# EAGLE design control (EAGLE 8.1.0)

## Sheet 1 of 3
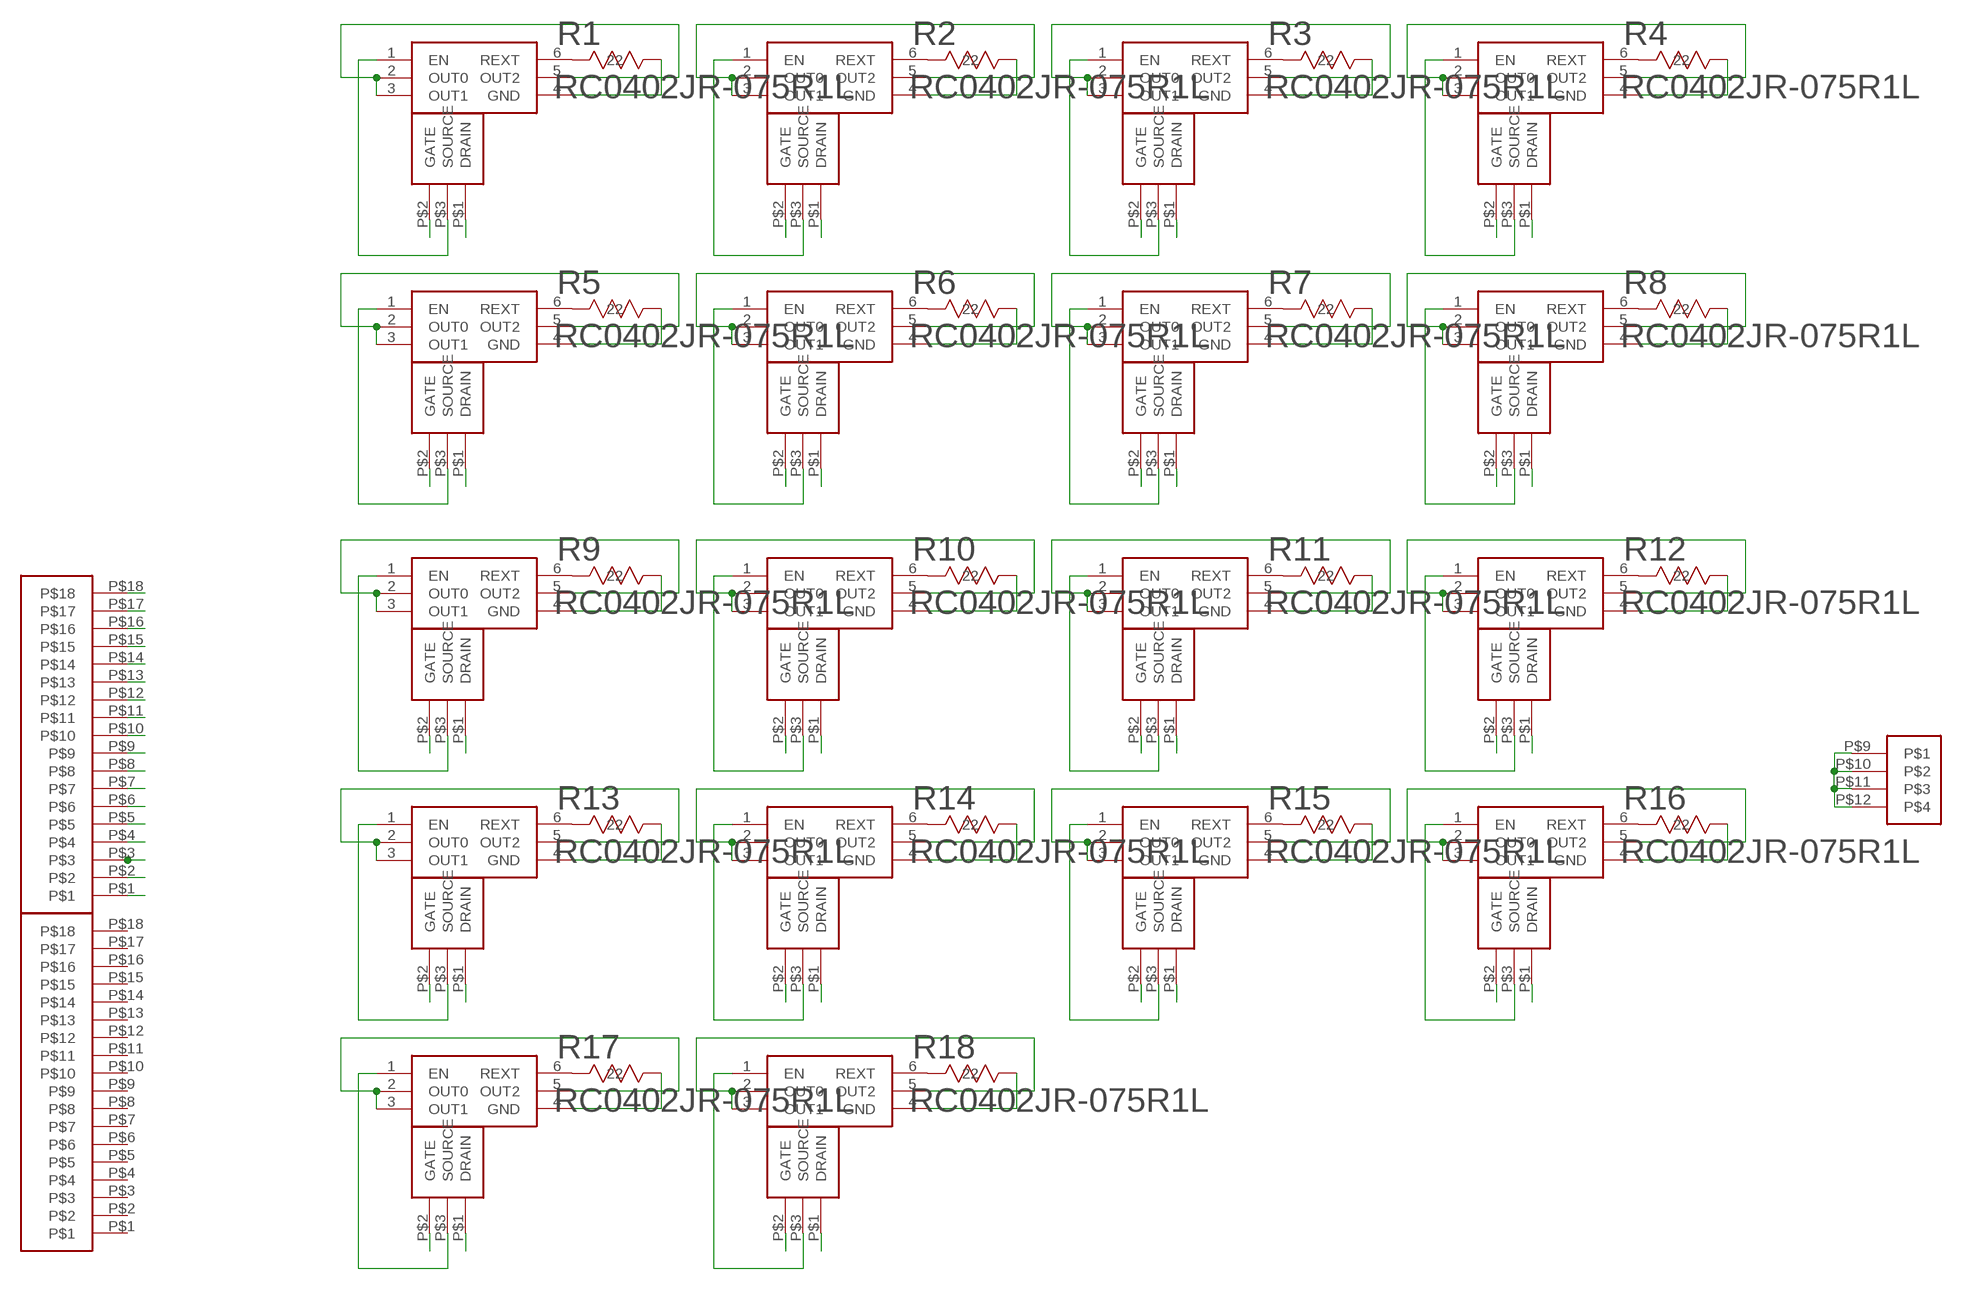
[diagram p0: schematic, sheet 1]

### Parts
R1  RC0402JR-075R1L  [RC0402N]
R2  RC0402JR-075R1L  [RC0402N]
R3  RC0402JR-075R1L  [RC0402N]
R4  RC0402JR-075R1L  [RC0402N]
R5  RC0402JR-075R1L  [RC0402N]
R6  RC0402JR-075R1L  [RC0402N]
R7  RC0402JR-075R1L  [RC0402N]
R8  RC0402JR-075R1L  [RC0402N]
R9  RC0402JR-075R1L  [RC0402N]
R10  RC0402JR-075R1L  [RC0402N]
R11  RC0402JR-075R1L  [RC0402N]
R12  RC0402JR-075R1L  [RC0402N]
R13  RC0402JR-075R1L  [RC0402N]
R14  RC0402JR-075R1L  [RC0402N]
R15  RC0402JR-075R1L  [RC0402N]
R16  RC0402JR-075R1L  [RC0402N]
R17  RC0402JR-075R1L  [RC0402N]
R18  RC0402JR-075R1L  [RC0402N]
U$2  BCR420UW6-7  [SOT26]
U$3  2N7002P  [SOT23]
U$4  BCR420UW6-7  [SOT26]
U$5  2N7002P  [SOT23]
U$6  BCR420UW6-7  [SOT26]
U$7  2N7002P  [SOT23]
U$8  BCR420UW6-7  [SOT26]
U$9  2N7002P  [SOT23]
U$10  BCR420UW6-7  [SOT26]
U$11  2N7002P  [SOT23]
U$12  BCR420UW6-7  [SOT26]
U$13  2N7002P  [SOT23]
U$14  BCR420UW6-7  [SOT26]
U$15  2N7002P  [SOT23]
U$16  BCR420UW6-7  [SOT26]
U$17  2N7002P  [SOT23]
U$18  BCR420UW6-7  [SOT26]
U$19  2N7002P  [SOT23]
U$20  BCR420UW6-7  [SOT26]
U$21  2N7002P  [SOT23]
U$22  BCR420UW6-7  [SOT26]
U$23  2N7002P  [SOT23]
U$24  BCR420UW6-7  [SOT26]
U$25  2N7002P  [SOT23]
U$26  BCR420UW6-7  [SOT26]
U$27  2N7002P  [SOT23]
U$28  BCR420UW6-7  [SOT26]
U$29  2N7002P  [SOT23]
U$30  BCR420UW6-7  [SOT26]
U$31  2N7002P  [SOT23]
U$32  BCR420UW6-7  [SOT26]
U$33  2N7002P  [SOT23]
U$34  BCR420UW6-7  [SOT26]
U$35  2N7002P  [SOT23]
U$38  2N7002P  [SOT23]
U$39  SFV4R-3STBE1HLF  [SFV4R-3STBE1HLF]
U$40  BCR420UW6-7  [SOT26]
U$44  SFV18R-3STBE1HLF  [SFV18R-3STBE1HLF]
U$80  SFV18R-3STBE1HLF  [SFV18R-3STBE1HLF]

### Nets
GND: R1.1 U$2.4(GND) U$38.P$1(DRAIN) U$39.P$9 U$39.P$10 U$39.P$11 U$39.P$12 ; also sheet 2,3
GND1: R2.1 U$3.P$1(DRAIN) U$4.4(GND)
GND2: R3.1 U$5.P$1(DRAIN) U$6.4(GND)
GND3: R4.1 U$7.P$1(DRAIN) U$8.4(GND)
GND4: R5.1 U$9.P$1(DRAIN) U$10.4(GND)
GND5: R6.1 U$11.P$1(DRAIN) U$12.4(GND)
GND6: R7.1 U$13.P$1(DRAIN) U$14.4(GND)
GND7: R8.1 U$15.P$1(DRAIN) U$16.4(GND)
GND8: R9.1 U$17.P$1(DRAIN) U$18.4(GND)
GND9: R10.1 U$19.P$1(DRAIN) U$20.4(GND)
GND10: R11.1 U$21.P$1(DRAIN) U$22.4(GND)
GND11: R12.1 U$23.P$1(DRAIN) U$24.4(GND)
GND12: R13.1 U$25.P$1(DRAIN) U$26.4(GND)
GND13: R14.1 U$27.P$1(DRAIN) U$28.4(GND)
GND14: R15.1 U$29.P$1(DRAIN) U$30.4(GND)
GND15: R16.1 U$31.P$1(DRAIN) U$32.4(GND)
GND16: R17.1 U$33.P$1(DRAIN) U$34.4(GND)
GND17: R18.1 U$35.P$1(DRAIN) U$40.4(GND)
LEDSTR_1: U$2.2(OUT0) U$2.3(OUT1) U$2.5(OUT2) U$44.P$1
LEDSTR_2: U$4.2(OUT0) U$4.3(OUT1) U$4.5(OUT2) U$44.P$2
LEDSTR_3: U$6.2(OUT0) U$6.3(OUT1) U$6.5(OUT2) U$44.P$3
LEDSTR_4: U$8.2(OUT0) U$8.3(OUT1) U$8.5(OUT2) U$44.P$4
LEDSTR_5: U$44.P$7
LEDSTR_6: U$44.P$6
LEDSTR_7: U$44.P$5
LEDSTR_8: U$44.P$8
LEDSTR_9: U$44.P$9
LEDSTR_10: U$44.P$10
LEDSTR_11: U$44.P$11
LEDSTR_12: U$44.P$12
LEDSTR_13: U$44.P$13
LEDSTR_14: U$44.P$14
LEDSTR_15: U$44.P$15
LEDSTR_16: U$44.P$16
LEDSTR_17: U$44.P$18
LEDSTR_18: U$44.P$17
LEDSTR_19: U$10.2(OUT0) U$10.3(OUT1) U$10.5(OUT2)
LEDSTR_20: U$12.2(OUT0) U$12.3(OUT1) U$12.5(OUT2)
LEDSTR_21: U$14.2(OUT0) U$14.3(OUT1) U$14.5(OUT2)
LEDSTR_22: U$16.2(OUT0) U$16.3(OUT1) U$16.5(OUT2)
LEDSTR_23: U$18.2(OUT0) U$18.3(OUT1) U$18.5(OUT2)
LEDSTR_24: U$20.2(OUT0) U$20.3(OUT1) U$20.5(OUT2)
LEDSTR_25: U$22.2(OUT0) U$22.3(OUT1) U$22.5(OUT2)
LEDSTR_26: U$24.2(OUT0) U$24.3(OUT1) U$24.5(OUT2)
LEDSTR_27: U$26.2(OUT0) U$26.3(OUT1) U$26.5(OUT2)
LEDSTR_28: U$28.2(OUT0) U$28.3(OUT1) U$28.5(OUT2)
LEDSTR_29: U$30.2(OUT0) U$30.3(OUT1) U$30.5(OUT2)
LEDSTR_30: U$32.2(OUT0) U$32.3(OUT1) U$32.5(OUT2)
LEDSTR_31: U$34.2(OUT0) U$34.3(OUT1) U$34.5(OUT2)
LEDSTR_32: U$40.2(OUT0) U$40.3(OUT1) U$40.5(OUT2)
N$1: R1.2 U$2.6(REXT)
N$2: U$2.1(EN) U$38.P$3(SOURCE)
N$3: U$3.P$3(SOURCE) U$4.1(EN)
N$4: R2.2 U$4.6(REXT)
N$5: U$5.P$3(SOURCE) U$6.1(EN)
N$6: R3.2 U$6.6(REXT)
N$7: U$7.P$3(SOURCE) U$8.1(EN)
N$8: R4.2 U$8.6(REXT)
N$9: U$9.P$3(SOURCE) U$10.1(EN)
N$10: R5.2 U$10.6(REXT)
N$11: U$11.P$3(SOURCE) U$12.1(EN)
N$12: R6.2 U$12.6(REXT)
N$13: U$13.P$3(SOURCE) U$14.1(EN)
N$14: R7.2 U$14.6(REXT)
N$15: U$15.P$3(SOURCE) U$16.1(EN)
N$16: R8.2 U$16.6(REXT)
N$17: U$17.P$3(SOURCE) U$18.1(EN)
N$18: R9.2 U$18.6(REXT)
N$19: U$19.P$3(SOURCE) U$20.1(EN)
N$20: R10.2 U$20.6(REXT)
N$21: U$21.P$3(SOURCE) U$22.1(EN)
N$22: R11.2 U$22.6(REXT)
N$23: U$23.P$3(SOURCE) U$24.1(EN)
N$24: R12.2 U$24.6(REXT)
N$25: U$25.P$3(SOURCE) U$26.1(EN)
N$26: R13.2 U$26.6(REXT)
N$27: U$27.P$3(SOURCE) U$28.1(EN)
N$28: R14.2 U$28.6(REXT)
N$29: U$29.P$3(SOURCE) U$30.1(EN)
N$30: R15.2 U$30.6(REXT)
N$31: U$31.P$3(SOURCE) U$32.1(EN)
N$32: R16.2 U$32.6(REXT)
N$35: U$33.P$3(SOURCE) U$34.1(EN)
N$36: R17.2 U$34.6(REXT)
N$37: U$35.P$3(SOURCE) U$40.1(EN)
N$38: R18.2 U$40.6(REXT)
ZN0: U$38.P$2(GATE) ; also sheet 3
ZN16: U$3.P$2(GATE)
ZN17: U$5.P$2(GATE)
ZN18: U$7.P$2(GATE)
ZN19: U$9.P$2(GATE)
ZN20: U$11.P$2(GATE)
ZN21: U$13.P$2(GATE)
ZN22: U$15.P$2(GATE)
ZN23: U$17.P$2(GATE)
ZN24: U$19.P$2(GATE)
ZN25: U$21.P$2(GATE)
ZN26: U$23.P$2(GATE)
ZN27: U$25.P$2(GATE)
ZN28: U$27.P$2(GATE)
ZN29: U$29.P$2(GATE)
ZN30: U$31.P$2(GATE)
ZN31: U$33.P$2(GATE)
ZN32: U$35.P$2(GATE)
Unconnected: U$80.P$1 U$80.P$2 U$80.P$3 U$80.P$4 U$80.P$5 U$80.P$6 U$80.P$7 U$80.P$8 U$80.P$9 U$80.P$10 U$80.P$11 U$80.P$12 U$80.P$13 U$80.P$14 U$80.P$15 U$80.P$16 U$80.P$17 U$80.P$18

## Sheet 2 of 3: Processors
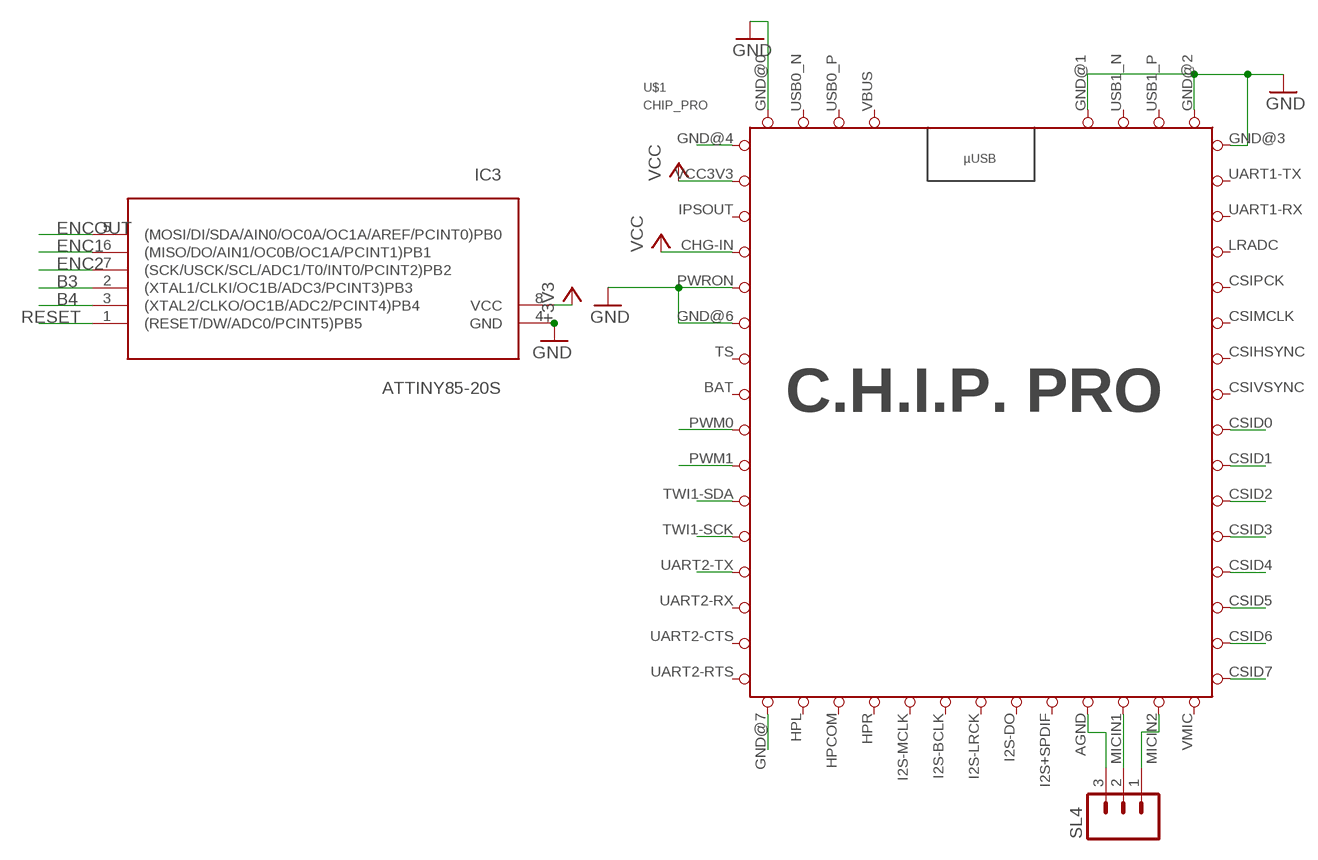
[diagram p1: schematic, sheet 2]

### Parts
IC3  ATTINY85-20S  ATTINY85V-10S  [SOIC8]
SL4  M03  [03P]
U$1  CHIP_PRO  [CHIP_PRO]

### Nets
3V3: U$1.VCC3V3 ; supply symbol labelled VCC ; also sheet 3
+3V3: IC3.8(VCC)
B3: IC3.2((XTAL1/CLKI/OC1B/ADC3/PCINT3)PB3)
B4: IC3.3((XTAL2/CLKO/OC1B/ADC2/PCINT4)PB4)
DIR1A: U$1.CSID4 ; also sheet 3
DIR1B: U$1.CSID5 ; also sheet 3
DIR2A: U$1.CSID6 ; also sheet 3
DIR2B: U$1.CSID7 ; also sheet 3
ENC1: IC3.6((MISO/DO/AIN1/OC0B/OC1A/PCINT1)PB1) ; also sheet 3
ENC2: IC3.7((SCK/USCK/SCL/ADC1/T0/INT0/PCINT2)PB2) ; also sheet 3
ENCOUT: IC3.5((MOSI/DI/SDA/AIN0/OC0A/OC1A/AREF/PCINT0)PB0) U$1.UART2-TX
ENDSTOP0: U$1.CSID0 ; also sheet 3
ENDSTOP1: U$1.CSID1 ; also sheet 3
ENDSTOP2: U$1.CSID2 ; also sheet 3
ENDSTOP3: U$1.CSID3 ; also sheet 3
GND: IC3.4(GND) U$1.GND@0(GND) U$1.GND@1(GND) U$1.GND@2(GND) U$1.GND@3(GND) U$1.GND@4(GND) U$1.GND@6(GND) U$1.GND@7(GND) U$1.PWRON ; also sheet 1,3
M1: U$1.PWM0 ; also sheet 3
M2: U$1.PWM1 ; also sheet 3
N$39: SL4.3 U$1.AGND
N$40: SL4.2 U$1.MICIN1
N$41: SL4.1 U$1.MICIN2
RESET: IC3.1((RESET/DW/ADC0/PCINT5)PB5)
SCK: U$1.TWI1-SCK ; also sheet 3
SDA: U$1.TWI1-SDA ; also sheet 3
VIN: U$1.CHG-IN ; supply symbol labelled VCC ; also sheet 3
Unconnected: U$1.BAT U$1.CSIHSYNC U$1.CSIMCLK U$1.CSIPCK U$1.CSIVSYNC U$1.HPCOM U$1.HPL U$1.HPR U$1.I2S+SPDIF(I2SSPDIF) U$1.I2S-BCLK(I2SBCLK) U$1.I2S-DO(I2SDO) U$1.I2S-LRCK(I2SLRCK) U$1.I2S-MCLK(I2SMCLK) U$1.LRADC U$1.TS U$1.UART1-RX U$1.UART1-TX U$1.UART2-CTS U$1.UART2-RTS U$1.UART2-RX U$1.USB0_N U$1.USB0_P U$1.USB1_N U$1.USB1_P U$1.VMIC

## Sheet 3 of 3: Power management
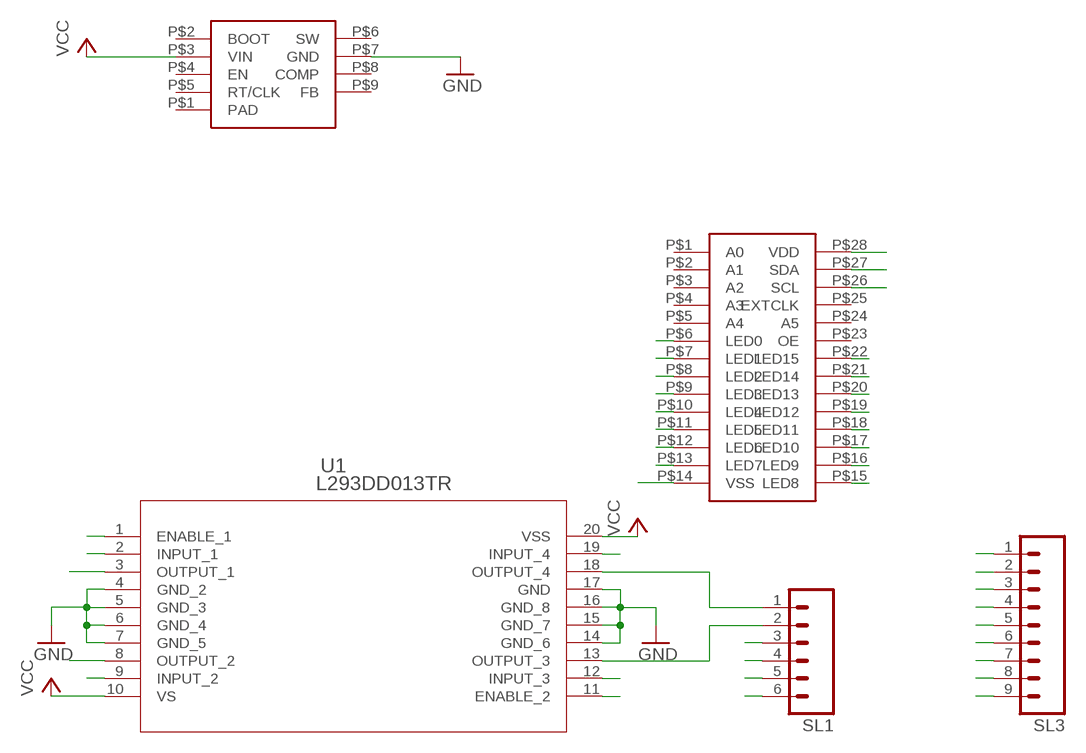
[diagram p2: schematic, sheet 3]

### Parts
SL1  M06  [06P]
SL3  M09  [09P]
U1  L293DD013TR  [SO-20]
U$37  PCA9685PW/Q900  [SOT361-1]
U$42  TPS54560DDAR  [8-S-POWERPAD]

### Nets
3V3: SL1.3 SL3.7 ; also sheet 2
5V: U1.20(VSS) U$37.P$28(VDD) ; supply symbol labelled VCC
DIR1A: U1.2(INPUT_1) ; also sheet 2
DIR1B: U1.9(INPUT_2) ; also sheet 2
DIR2A: U1.19(INPUT_4) ; also sheet 2
DIR2B: U1.12(INPUT_3) ; also sheet 2
ENC1: SL1.5 ; also sheet 2
ENC2: SL1.6 ; also sheet 2
ENDSTOP0: SL3.3 ; also sheet 2
ENDSTOP1: SL3.4 ; also sheet 2
ENDSTOP2: SL3.5 ; also sheet 2
ENDSTOP3: SL3.6 ; also sheet 2
GND: SL1.4 SL3.2 U1.4(GND_2) U1.5(GND_3) U1.6(GND_4) U1.7(GND_5) U1.14(GND_6) U1.15(GND_7) U1.16(GND_8) U1.17(GND) U$37.P$14(VSS) U$42.P$7(GND) ; also sheet 1,2
M1: U1.1(ENABLE_1) ; also sheet 2
M1A: SL3.8 U1.3(OUTPUT_1)
M1B: SL3.9 U1.8(OUTPUT_2)
M2: U1.11(ENABLE_2) ; also sheet 2
M2A: SL1.1 U1.18(OUTPUT_4)
M2B: SL1.2 U1.13(OUTPUT_3)
SCK: U$37.P$26(SCL) ; also sheet 2
SDA: U$37.P$27(SDA) ; also sheet 2
VCC: U1.10(VS)
VIN: SL3.1 U$42.P$3(VIN) ; supply symbol labelled VCC ; also sheet 2
ZN0: U$37.P$13(LED7) ; also sheet 1
ZN1: U$37.P$12(LED6)
ZN2: U$37.P$11(LED5)
ZN3: U$37.P$10(LED4)
ZN4: U$37.P$9(LED3)
ZN5: U$37.P$8(LED2)
ZN6: U$37.P$7(LED1)
ZN7: U$37.P$6(LED0)
ZN8: U$37.P$15(LED8)
ZN9: U$37.P$16(LED9)
ZN10: U$37.P$17(LED10)
ZN11: U$37.P$18(LED11)
ZN12: U$37.P$19(LED12)
ZN13: U$37.P$20(LED13)
ZN14: U$37.P$21(LED14)
ZN15: U$37.P$22(LED15)
Unconnected: U$37.P$1(A0) U$37.P$2(A1) U$37.P$3(A2) U$37.P$4(A3) U$37.P$5(A4) U$37.P$23(OE) U$37.P$24(A5) U$37.P$25(EXTCLK) U$42.P$1(PAD) U$42.P$2(BOOT) U$42.P$4(EN) U$42.P$5(RT/CLK) U$42.P$6(SW) U$42.P$8(COMP) U$42.P$9(FB)

## Power pins joined to a net without a drawn wire
IPSOUT: U$1.IPSOUT
VBUS: U$1.VBUS

## Library data of the parts
IC3 = avr:ATTINY85: MICROCONTROLLER 8 Kbytes FLASH 512 bytes EEPROM 512 bytes RAM 4-channel 10 bit ADC USI
R1-R18 = Smile_Shade:RC0402JR-075R1L; MANUFACTURER_PART_NUMBER: RC0402JR075R1L; VENDOR: Yageo
SL1 = con-amp-quick:M06: AMP QUICK CONNECTOR; OC_FARNELL: unknown; OC_NEWARK: unknown
SL3 = con-amp-quick:M09: AMP QUICK CONNECTOR; OC_FARNELL: unknown; OC_NEWARK: unknown
SL4 = con-amp-quick:M03: AMP QUICK CONNECTOR; OC_FARNELL: unknown; OC_NEWARK: unknown
U1 = Smile_Shade:L293DD013TR; MANUFACTURER_PART_NUMBER: L293DD; VENDOR: ST Microelectronics
U$1 = CHIP_Pro-Footprint:CHIP_PRO
U$2 U$4 U$6 U$8 U$10 U$12 U$14 U$16 U$18 U$20 U$22 U$24 U$26 U$28 U$30 U$32 U$34 U$40 = Smile_Shade:BCR420UW6-7
U$3 U$5 U$7 U$9 U$11 U$13 U$15 U$17 U$19 U$21 U$23 U$25 U$27 U$29 U$31 U$33 U$35 U$38 = Smile_Shade:2N7002P
U$37 = Smile_Shade:PCA9685PW/Q900
U$39 = Smile_Shade:SFV4R-3STBE1HLF
U$42 = Smile_Shade:TPS54560DDAR
U$44 U$80 = Smile_Shade:SFV18R-3STBE1HLF

## Board
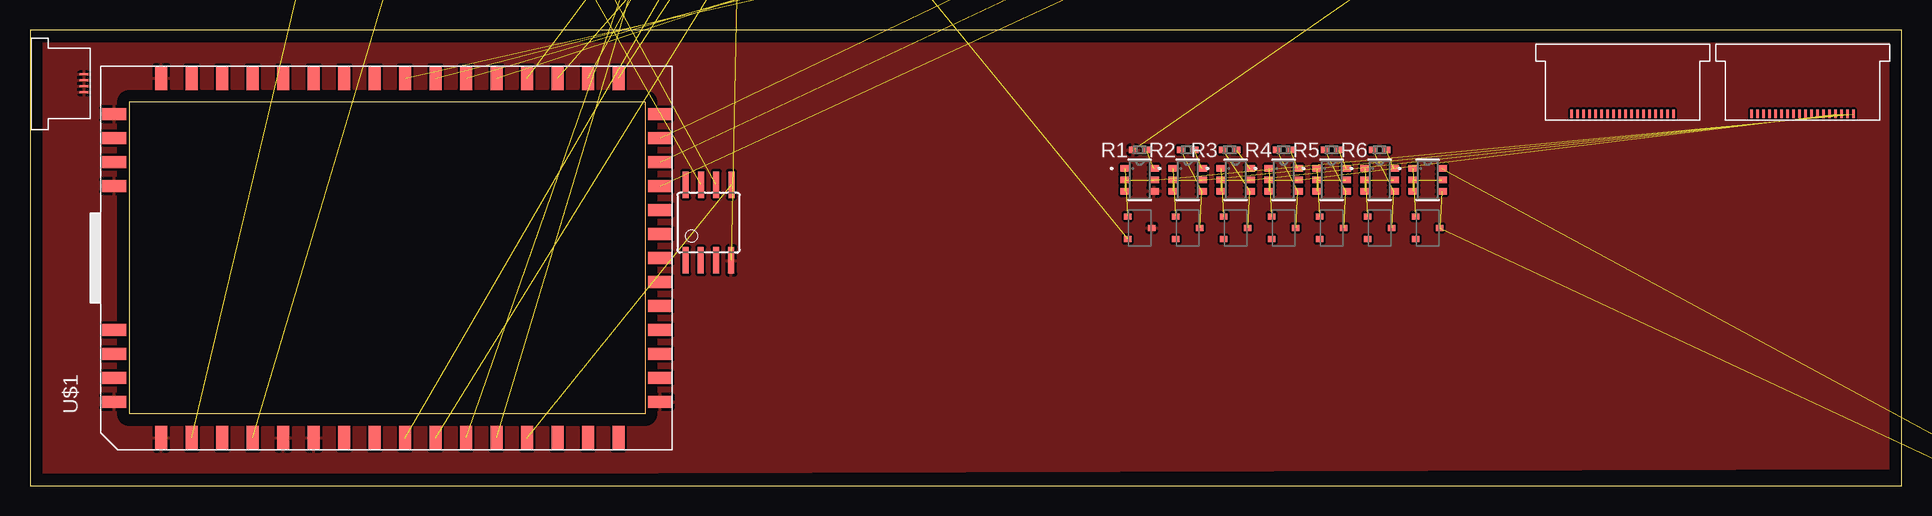
[diagram p3: board, top side]
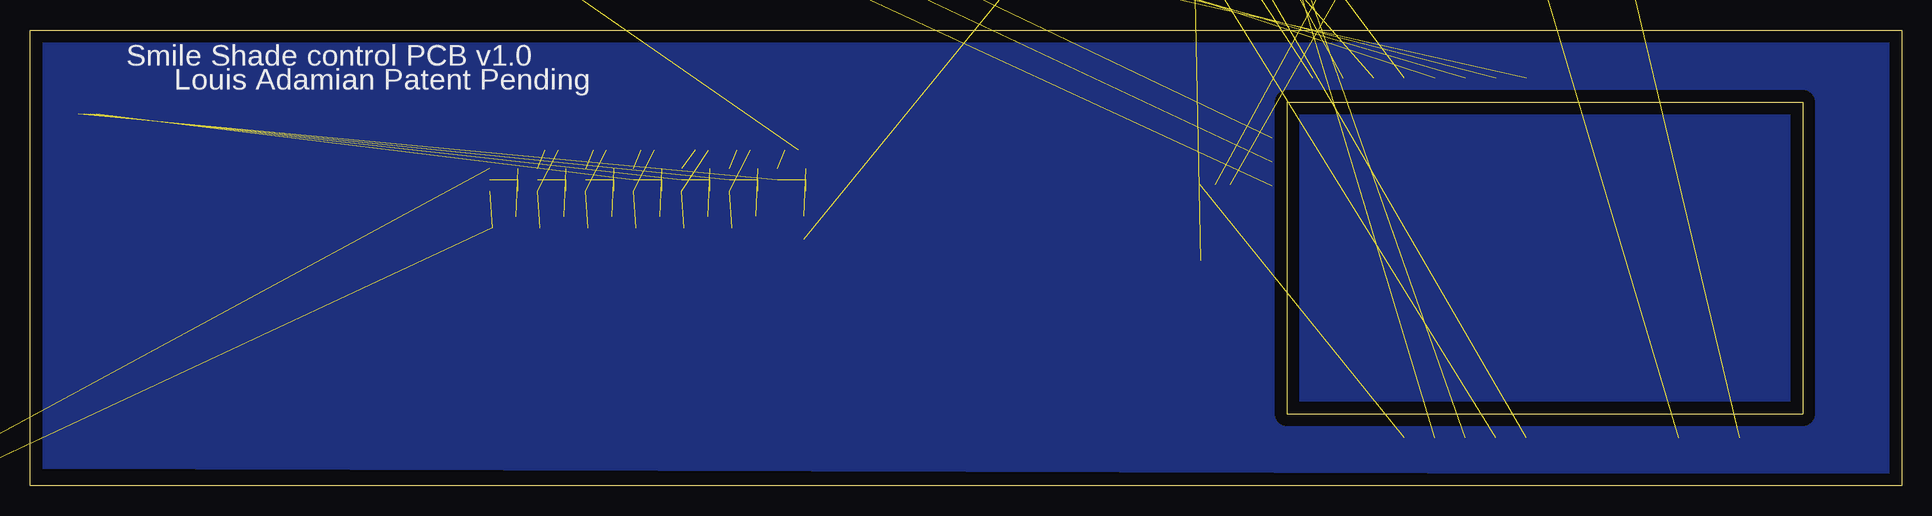
[diagram p4: board, bottom side, seen from below]

Size 156 x 38 mm. Coordinates in mm from the lower left corner, seen from the top.
Outline: 0,0 156,0 156,38 0,38 0,0
Copper layers (1*16): Top 0.035mm / dielectric 1.5mm / Bottom 0.035mm
Design rules "default *": minimum track width 10mil, minimum drill 24mil, track to track 8mil, track to pad 8mil, pad to pad 8mil, via to via 8mil, smd to smd 8mil, copper to edge 40mil, drill to drill 8mil, minimum pad ring 10mil, minimum via ring 8mil, stop-mask expansion 4mil, vias tented up to drill 0mil, thermal gap 10mil

### Footprints (pad centres in the part's own frame; a part is rotated, then mirrored left to right if it is on the bottom)
SOIC8 = smd 0.5 x 2.2: 1 -1.905,-3.154; 2 -0.645,-3.154; 3 0.625,-3.154; 4 1.895,-3.154; 5 1.905,3.154; 6 0.635,3.154; 7 -0.635,3.154; 8 -1.905,3.154
RC0402N = smd 0.66 x 0.508: 1 -0.559,0; 2 0.559,0
06P = drill 0.914 long: 1 -6.35,0; 2 -3.81,0; 3 -1.27,0; 4 1.27,0; 5 3.81,0; 6 6.35,0
09P = drill 0.914 long: 1 -10.16,0; 2 -7.62,0; 3 -5.08,0; 4 -2.54,0; 5 0,0; 6 2.54,0; 7 5.08,0; 8 7.62,0; 9 10.16,0
03P = drill 0.914 long: 1 -2.54,0; 2 0,0; 3 2.54,0
SO-20 = smd 1.981 x 0.559: 1 -4.686,5.715; 2 -4.686,4.445; 3 -4.686,3.175; 4 -4.686,1.905; 5 -4.686,0.635; 6 -4.686,-0.635; 7 -4.686,-1.905; 8 -4.686,-3.175; 9 -4.686,-4.445; 10 -4.686,-5.715; 11 4.686,-5.715; 12 4.686,-4.445; 13 4.686,-3.175; 14 4.686,-1.905; 15 4.686,-0.635; 16 4.686,0.635; 17 4.686,1.905; 18 4.686,3.175; 19 4.686,4.445; 20 4.686,5.715
CHIP_PRO = smd 1 x 2: AGND 6,-22.5; GND@1 -12,-22.5; GND@4 -12,23; GND@6 6,23; GND@7 12,23; HPCOM -8,-22.5; HPL -10,-22.5; HPR -6,-22.5; I2S+SPDIF 4,-22.5; I2S-BCLK -2,-22.5; I2S-DO 2,-22.5; I2S-LRCK 0,-22.5; I2S-MCLK -4,-22.5; MICIN1 8,-22.5; MICIN2 10,-22.5; USB0_N -10,23; USB0_P -8,23; USB1_N 8,23; USB1_P 10,23; VBUS -6,23; VMIC 12,-22.5 | smd 2 x 1: BAT -15,1.27; CHG-IN -15,11.43; CSID0 15,-1.27; CSID1 15,-3.81; CSID2 15,-6.35; CSID3 15,-8.89; CSID4 15,-11.43; CSID5 15,-13.97; CSID6 15,-16.51; CSID7 15,-19.05; CSIHSYNC 15,3.81; CSIMCLK 15,6.35; CSIPCK 15,8.89; CSIVSYNC 15,1.27; GND@0 15,19.05; GND@2 -15,6.35; GND@3 -15,19.05; IPSOUT -15,13.97; LRADC 15,11.43; PWM0 -15,-1.27; PWM1 -15,-3.81; PWRON -15,8.89; TS -15,3.81; TWI1-SCK -15,-8.89; TWI1-SDA -15,-6.35; UART1-RX 15,13.97; UART1-TX 15,16.51; UART2-CTS -15,-16.51; UART2-RTS -15,-19.05; UART2-RX -15,-13.97; UART2-TX -15,-11.43; VCC3V3 -15,16.51
SOT26 = smd 0.8 x 0.55: 1 -1.2,0.95; 2 -1.2,0; 3 -1.2,-0.95; 4 1.2,-0.95; 5 1.2,0; 6 1.2,0.95
SOT23 = smd 0.5 x 0.6: P$1 0,-1; P$2 -0.95,1; P$3 0.95,1
SOT361-1 = smd 0.3 x 0.75: P$1 -4.125,-3.225; P$2 -3.475,-3.225; P$3 -2.825,-3.225; P$4 -2.175,-3.225; P$5 -1.525,-3.225; P$6 -0.875,-3.225; P$7 -0.225,-3.225; P$8 0.425,-3.225; P$9 1.075,-3.225; P$10 1.725,-3.225; P$11 2.375,-3.225; P$12 3.025,-3.225; P$13 3.675,-3.225; P$14 4.325,-3.225; P$15 -4.225,3.225; P$16 -3.575,3.225; P$17 -2.925,3.225; P$18 -2.275,3.225; P$19 -1.625,3.225; P$20 -0.975,3.225; P$21 -0.325,3.225; P$22 0.325,3.225; P$23 0.975,3.225; P$24 1.625,3.225; P$25 2.275,3.225; P$26 2.925,3.225; P$27 3.575,3.225; P$28 4.225,3.225
SFV4R-3STBE1HLF = smd 0.18 x 0.7: P$9 2.2,-0.5; P$10 2.7,-0.5; P$11 3.2,-0.5; P$12 3.7,-0.5
8-S-POWERPAD = smd 2.4 x 3.1: P$1 0,0 | smd 2.15 x 0.45: P$2 2.875,1.905; P$3 2.875,0.635; P$4 2.875,-0.635; P$5 2.875,-1.905; P$6 -2.875,1.905; P$7 -2.875,0.635; P$8 -2.875,-0.635; P$9 -2.875,-1.905
SFV18R-3STBE1HLF = smd 0.18 x 0.7: P$1 0,0; P$2 0.5,0; P$3 1,0; P$4 1.5,0; P$5 2,0; P$6 2.5,0; P$7 3,0; P$8 3.5,0; P$9 4,0; P$10 4.5,0; P$11 5,0; P$12 5.5,0; P$13 6,0; P$14 6.5,0; P$15 7,0; P$16 7.5,0; P$17 8,0; P$18 8.5,0

### Placement (x,y rotation side)
IC3  56.56,21.94 0 top
R1  92.5,28 0 top
R2  96.5,28 0 top
R3  100,28 0 top
R4  104.5,28 0 top
R5  108.5,28 0 top
R6  112.5,28 0 top
R7  178,-6.5 0 top  (outside the outline)
R8  183.5,-6.5 0 top  (outside the outline)
R9  183,-25 0 top  (outside the outline)
R10  188.5,-25 0 top  (outside the outline)
R11  178,-29 0 top  (outside the outline)
R12  183.5,-29 0 top  (outside the outline)
R13  189,-29 0 top  (outside the outline)
R14  178,-31.5 0 top  (outside the outline)
R15  183.5,-31.5 0 top  (outside the outline)
R16  189,-31.5 0 top  (outside the outline)
R17  183,-54 0 top  (outside the outline)
R18  188.5,-54 0 top  (outside the outline)
SL1  30.5,81 180 top  (outside the outline)
SL3  128.5,61 90 top  (outside the outline)
SL4  120.5,59 270 top  (outside the outline)
U1  83.5,89 90 top  (outside the outline)
U$1  30,19 90 top
U$2  92.5,25.5 0 top
U$3  96.5,21.5 90 top
U$4  96.5,25.5 0 top
U$5  100.5,21.5 90 top
U$6  100.5,25.5 0 top
U$7  104.5,21.5 90 top
U$8  104.5,25.5 0 top
U$9  108.5,21.5 90 top
U$10  108.5,25.5 0 top
U$11  112.5,21.5 90 top
U$12  112.5,25.5 0 top
U$13  116.5,21.5 90 top
U$14  116.5,25.5 0 top
U$15  186,7 0 top  (outside the outline)
U$16  182,-1 0 top  (outside the outline)
U$17  175.5,-10 0 top  (outside the outline)
U$18  187,-14 0 top  (outside the outline)
U$19  179,-10 0 top  (outside the outline)
U$20  176.5,-18 0 top  (outside the outline)
U$21  182.5,-10 0 top  (outside the outline)
U$22  182,-18 0 top  (outside the outline)
U$23  186,-10 0 top  (outside the outline)
U$24  187.5,-18 0 top  (outside the outline)
U$25  189.5,-10 0 top  (outside the outline)
U$26  176.5,-22 0 top  (outside the outline)
U$27  175.5,-14 0 top  (outside the outline)
U$28  182,-22 0 top  (outside the outline)
U$29  179,-14 0 top  (outside the outline)
U$30  187.5,-22 0 top  (outside the outline)
U$31  182.5,-14 0 top  (outside the outline)
U$32  176.5,-26 0 top  (outside the outline)
U$33  175.5,-35 0 top  (outside the outline)
U$34  176.5,-43 0 top  (outside the outline)
U$35  179,-35 0 top  (outside the outline)
U$37  55,64 0 top  (outside the outline)
U$38  92.5,21.5 90 top
U$39  5,36.5 270 top
U$40  182,-43 0 top  (outside the outline)
U$42  41.5,76 90 top  (outside the outline)
U$44  152,31 180 top
U$80  137,31 180 top

### Tracks (layer width: path | path; a pad name or v marks a point on that pad's centre or on a via)
3V3  (2 unrouted)
5V  (1 unrouted)
48VDD
  pour Bottom: 155,37 1,37 1,1 155,1.5
DIR1A  (1 unrouted)
DIR1B  (1 unrouted)
DIR2A  (1 unrouted)
DIR2B  (1 unrouted)
ENC1  (1 unrouted)
ENC2  (1 unrouted)
ENCOUT  (1 unrouted)
ENDSTOP0  (1 unrouted)
ENDSTOP1  (1 unrouted)
ENDSTOP2  (1 unrouted)
ENDSTOP3  (1 unrouted)
GND  (12 unrouted)
  pour Top: 1,37 1,1 155,1.5 155,37
GND1  (2 unrouted)
GND2  (2 unrouted)
GND3  (2 unrouted)
GND4  (2 unrouted)
GND5  (2 unrouted)
GND6  (2 unrouted)
GND7  (2 unrouted)
GND8  (2 unrouted)
GND9  (2 unrouted)
GND10  (2 unrouted)
GND11  (2 unrouted)
GND12  (2 unrouted)
GND13  (2 unrouted)
GND14  (2 unrouted)
GND15  (2 unrouted)
GND16  (2 unrouted)
GND17  (2 unrouted)
LEDSTR_1  (3 unrouted)
LEDSTR_2  (3 unrouted)
LEDSTR_3  (3 unrouted)
LEDSTR_4  (3 unrouted)
LEDSTR_19  (2 unrouted)
LEDSTR_20  (2 unrouted)
LEDSTR_21  (2 unrouted)
LEDSTR_22  (2 unrouted)
LEDSTR_23  (2 unrouted)
LEDSTR_24  (2 unrouted)
LEDSTR_25  (2 unrouted)
LEDSTR_26  (2 unrouted)
LEDSTR_27  (2 unrouted)
LEDSTR_28  (2 unrouted)
LEDSTR_29  (2 unrouted)
LEDSTR_30  (2 unrouted)
LEDSTR_31  (2 unrouted)
LEDSTR_32  (2 unrouted)
M1  (1 unrouted)
M1A  (1 unrouted)
M1B  (1 unrouted)
M2  (1 unrouted)
M2A  (1 unrouted)
M2B  (1 unrouted)
N$1  (1 unrouted)
N$2  (1 unrouted)
  Top 0.254: 91.5,22.5 U$38.P$3
N$3  (1 unrouted)
  Top 0.254: 95.5,22.5 U$3.P$3
N$4  (1 unrouted)
N$5  (1 unrouted)
N$6  (1 unrouted)
N$7  (1 unrouted)
N$8  (1 unrouted)
N$9  (1 unrouted)
N$10  (1 unrouted)
N$11  (1 unrouted)
N$12  (1 unrouted)
N$13  (1 unrouted)
N$14  (1 unrouted)
N$15  (1 unrouted)
N$16  (1 unrouted)
N$17  (1 unrouted)
N$18  (1 unrouted)
N$19  (1 unrouted)
N$20  (1 unrouted)
N$21  (1 unrouted)
N$22  (1 unrouted)
N$23  (1 unrouted)
N$24  (1 unrouted)
N$25  (1 unrouted)
N$26  (1 unrouted)
N$27  (1 unrouted)
N$28  (1 unrouted)
N$29  (1 unrouted)
N$30  (1 unrouted)
N$31  (1 unrouted)
N$32  (1 unrouted)
N$35  (1 unrouted)
N$36  (1 unrouted)
N$37  (1 unrouted)
N$38  (1 unrouted)
N$39  (1 unrouted)
N$40  (1 unrouted)
N$41  (1 unrouted)
SCK  (1 unrouted)
SDA  (1 unrouted)
VIN  (2 unrouted)
ZN0  (1 unrouted)

### Text on the board
bNames: Smile Shade control PCB v1.0 | Louis Adamian Patent Pending